# Altium schematic sheet SCH_CAN_Transceiver_TJA1050.SchDoc
size A; SheetNumber: 2; SheetTotal: 3
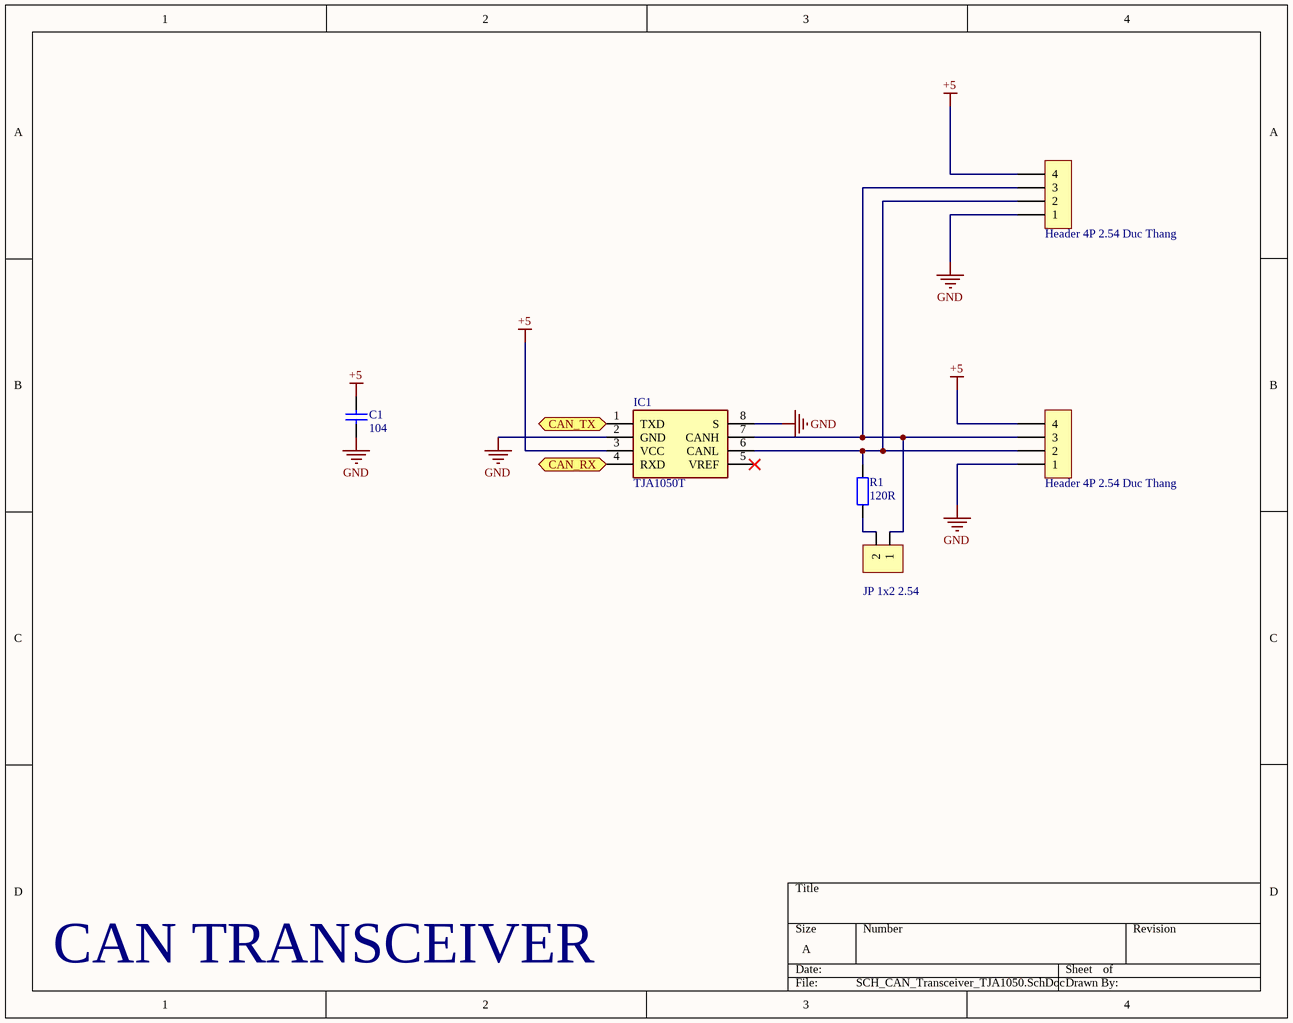
[diagram p0: SCH_CAN_Transceiver_TJA1050.SchDoc]

## Parts
C1  104  [tu 0603]
H1  Header 4P 2.54 Duc Thang  [XH2.54M-4]
H2  Header 4P 2.54 Duc Thang  [XH2.54M-4]
IC1  TJA1050T  [SOIC127P600X175-8N]
JP1  JP 1x2 2.54  [JP 1x2 DT]
R1  120R  [tro smd 0603]

## Ports
CAN_RX (bidir), CAN_TX (bidir)

## Nets
+5: C1.1 H1.4 H2.4 IC1.3(VCC)
GND: C1.2 H1.1 H2.1 IC1.2(GND) IC1.8(S)
CAN_RX: IC1.4(RXD) ; port CAN_RX
CAN_TX: IC1.1(TXD) ; port CAN_TX
NetH1_2: H1.2 H2.2 IC1.6(CANL) R1.2
NetH1_3: H1.3 H2.3 IC1.7(CANH) JP1.1
NetJP1_2: JP1.2 R1.1

Not connected (* = marked no-connect by the designer): IC1 5(VREF)*

## Notes on the sheet
- CAN TRANSCEIVER

## Library data of the parts
C1 = Tu 0603 104 50V 10%: Dán; Don_Vi: Con; So_Chan: 2; Ten_Linh_Kien: Tụ 0603 104-100nF 10% 50V; Ma_Hang: MH004568; Chung_Loai: Dán; Kieu_Chan: *
H1 H2 = Header 4P 2.54 Duc Thang: Cắm; Ten_Linh_Kien: Header 4P XH2.54-4P Đực Thẳng; Don_Vi: Con; Ma_Hang: MH001285; Chung_Loai: Cắm
IC1 = TJA1050T: Integrated Circuit; Manufacturer_Name: NXP; Datasheet Link: https://datasheet.datasheetarchive.com/originals/distributors/Datasheets-NXP/DSANXP010005907.pdf; Height: 1.75mm; Manufacturer_Part_Number: TJA1050T; Mouser Part Number: N/A; Mouser Price/Stock: https://www.mouser.co.uk/ProductDetail/NXP-Semiconductors/TJA1050T?qs=WhRErS6oET%252B5mtiFrt9ZMQ%3D%3D
JP1 = JP 1x2 2.54 Duc Thang: Cắm; Ten_Linh_Kien: Jump Đơn Đực 2.54MM 1x40P Thẳng 11MM; Don_Vi: Con; Ma_Hang: MH000903; Ghi_Chu: *; Kieu_Chan: *; Chung_Loai: Cắm
R1 = Tro 0603 1% 0R: Dán; Don_Vi: Con; So_Chan: 2; Ten_Linh_Kien: Trở 0603 1% 0R; Ma_Hang: MH005792; Chung_Loai: Dán; Kieu_Chan: *